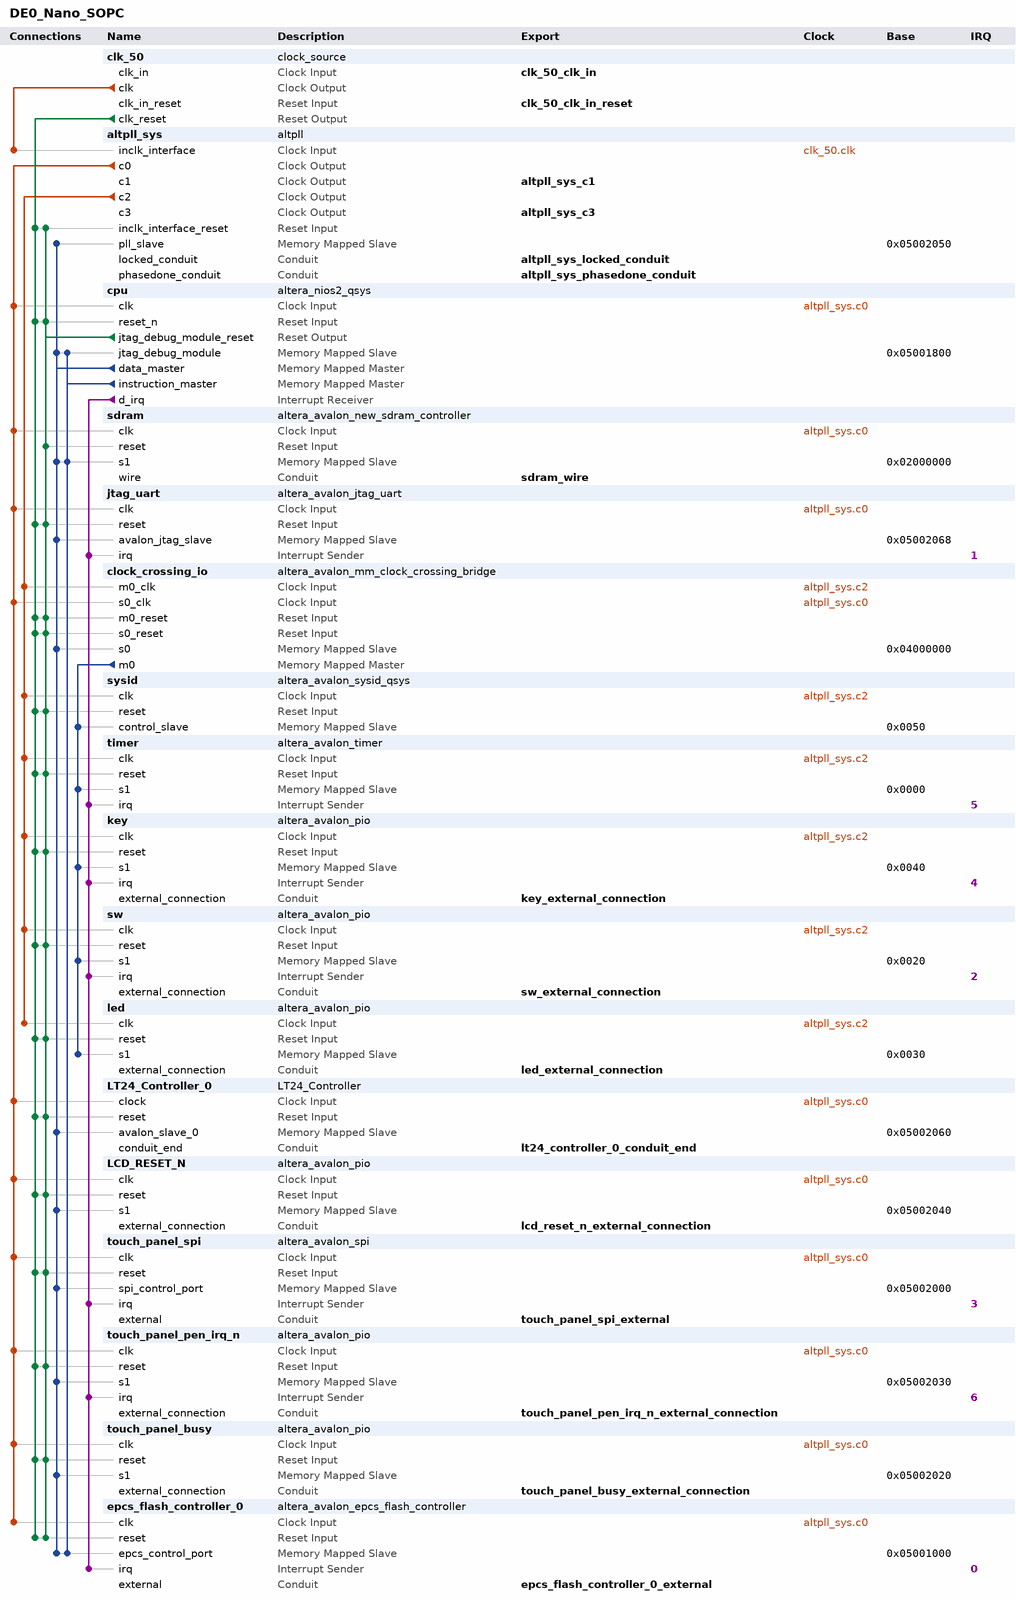
[diagram p0: system contents]
# Platform Designer (Qsys) system DE0_Nano_SOPC, Cyclone IV E EP4CE22F17C6
# Parameters at their usual value, and those the tool derives, are not listed.
package require -exact qsys 13.1
create_system DE0_Nano_SOPC
set_project_property DEVICE_FAMILY {Cyclone IV E}
set_project_property DEVICE EP4CE22F17C6

add_instance clk_50 clock_source 13.1
set_instance_parameter_value clk_50 clockFrequency 50000000

add_instance altpll_sys altpll 13.1
set_instance_parameter_value altpll_sys INCLK0_INPUT_FREQUENCY 20000
set_instance_parameter_value altpll_sys CLK0_MULTIPLY_BY 2
set_instance_parameter_value altpll_sys CLK1_MULTIPLY_BY 2
set_instance_parameter_value altpll_sys CLK2_MULTIPLY_BY 1
set_instance_parameter_value altpll_sys CLK3_MULTIPLY_BY 4
set_instance_parameter_value altpll_sys CLK4_MULTIPLY_BY 1
set_instance_parameter_value altpll_sys CLK0_DIVIDE_BY 1
set_instance_parameter_value altpll_sys CLK1_DIVIDE_BY 1
set_instance_parameter_value altpll_sys CLK2_DIVIDE_BY 5
set_instance_parameter_value altpll_sys CLK3_DIVIDE_BY 5
set_instance_parameter_value altpll_sys CLK4_DIVIDE_BY 25
set_instance_parameter_value altpll_sys CLK1_PHASE_SHIFT -2500
set_instance_parameter_value altpll_sys CLK2_PHASE_SHIFT 0
set_instance_parameter_value altpll_sys CLK3_PHASE_SHIFT 0
set_instance_parameter_value altpll_sys CLK4_PHASE_SHIFT 0
set_instance_parameter_value altpll_sys CLK1_DUTY_CYCLE 50
set_instance_parameter_value altpll_sys CLK2_DUTY_CYCLE 50
set_instance_parameter_value altpll_sys CLK3_DUTY_CYCLE 50
set_instance_parameter_value altpll_sys CLK4_DUTY_CYCLE 50
set_instance_parameter_value altpll_sys PORT_clk1 PORT_USED
set_instance_parameter_value altpll_sys PORT_clk2 PORT_USED
set_instance_parameter_value altpll_sys PORT_clk3 PORT_USED
set_instance_parameter_value altpll_sys PORT_clk4 PORT_USED
set_instance_parameter_value altpll_sys PORT_ARESET PORT_USED
set_instance_parameter_value altpll_sys PORT_LOCKED PORT_USED

add_instance cpu altera_nios2_qsys 13.1
set_instance_parameter_value cpu manuallyAssignCpuID false
set_instance_parameter_value cpu resetSlave epcs_flash_controller_0.epcs_control_port
set_instance_parameter_value cpu exceptionSlave sdram.s1
set_instance_parameter_value cpu breakSlave cpu.jtag_debug_module
set_instance_parameter_value cpu impl Fast
set_instance_parameter_value cpu icache_size 4096

add_instance sdram altera_avalon_new_sdram_controller 13.1
set_instance_parameter_value sdram TAC 5.5
set_instance_parameter_value sdram TRCD 20.0
set_instance_parameter_value sdram TRP 20.0
set_instance_parameter_value sdram casLatency 3
set_instance_parameter_value sdram columnWidth 9
set_instance_parameter_value sdram dataWidth 16
set_instance_parameter_value sdram generateSimulationModel true
set_instance_parameter_value sdram model custom
set_instance_parameter_value sdram numberOfBanks 4
set_instance_parameter_value sdram numberOfChipSelects 1
set_instance_parameter_value sdram powerUpDelay 100.0
set_instance_parameter_value sdram refreshPeriod 15.625
set_instance_parameter_value sdram rowWidth 13

add_instance jtag_uart altera_avalon_jtag_uart 13.1
set_instance_parameter_value jtag_uart simInteractiveOptions INTERACTIVE_ASCII_OUTPUT

add_instance clock_crossing_io altera_avalon_mm_clock_crossing_bridge 13.1
set_instance_parameter_value clock_crossing_io DATA_WIDTH 32
set_instance_parameter_value clock_crossing_io ADDRESS_WIDTH 7
set_instance_parameter_value clock_crossing_io MAX_BURST_SIZE 1
set_instance_parameter_value clock_crossing_io COMMAND_FIFO_DEPTH 16
set_instance_parameter_value clock_crossing_io RESPONSE_FIFO_DEPTH 32
set_instance_parameter_value clock_crossing_io MASTER_SYNC_DEPTH 3
set_instance_parameter_value clock_crossing_io SLAVE_SYNC_DEPTH 3

add_instance sysid altera_avalon_sysid_qsys 13.1
set_instance_parameter_value sysid id 0

add_instance timer altera_avalon_timer 13.1
set_instance_parameter_value timer period 1
set_instance_parameter_value timer periodUnits MSEC

add_instance key altera_avalon_pio 13.1
set_instance_parameter_value key captureEdge true
set_instance_parameter_value key direction Input
set_instance_parameter_value key edgeType FALLING
set_instance_parameter_value key generateIRQ true
set_instance_parameter_value key irqType EDGE
set_instance_parameter_value key width 2

add_instance sw altera_avalon_pio 13.1
set_instance_parameter_value sw captureEdge true
set_instance_parameter_value sw direction Input
set_instance_parameter_value sw edgeType ANY
set_instance_parameter_value sw generateIRQ true
set_instance_parameter_value sw irqType EDGE
set_instance_parameter_value sw width 4

add_instance led altera_avalon_pio 13.1
set_instance_parameter_value led direction Output
set_instance_parameter_value led width 8

add_instance LT24_Controller_0 LT24_Controller 1.0

add_instance LCD_RESET_N altera_avalon_pio 13.1
set_instance_parameter_value LCD_RESET_N direction Output
set_instance_parameter_value LCD_RESET_N width 1

add_instance touch_panel_spi altera_avalon_spi 13.1
set_instance_parameter_value touch_panel_spi clockPolarity 0
set_instance_parameter_value touch_panel_spi dataWidth 8
set_instance_parameter_value touch_panel_spi masterSPI true
set_instance_parameter_value touch_panel_spi numberOfSlaves 1
set_instance_parameter_value touch_panel_spi targetClockRate 32000

add_instance touch_panel_pen_irq_n altera_avalon_pio 13.1
set_instance_parameter_value touch_panel_pen_irq_n captureEdge true
set_instance_parameter_value touch_panel_pen_irq_n direction Input
set_instance_parameter_value touch_panel_pen_irq_n edgeType FALLING
set_instance_parameter_value touch_panel_pen_irq_n generateIRQ true
set_instance_parameter_value touch_panel_pen_irq_n irqType EDGE
set_instance_parameter_value touch_panel_pen_irq_n width 1

add_instance touch_panel_busy altera_avalon_pio 13.1
set_instance_parameter_value touch_panel_busy direction Input
set_instance_parameter_value touch_panel_busy width 1

add_instance epcs_flash_controller_0 altera_avalon_epcs_flash_controller 13.1

# connections
add_connection altpll_sys.c0 clock_crossing_io.s0_clk clock
add_connection altpll_sys.c0 cpu.clk clock
add_connection altpll_sys.c0 epcs_flash_controller_0.clk clock
add_connection altpll_sys.c0 jtag_uart.clk clock
add_connection altpll_sys.c0 LCD_RESET_N.clk clock
add_connection altpll_sys.c0 LT24_Controller_0.clock clock
add_connection altpll_sys.c0 sdram.clk clock
add_connection altpll_sys.c0 touch_panel_busy.clk clock
add_connection altpll_sys.c0 touch_panel_pen_irq_n.clk clock
add_connection altpll_sys.c0 touch_panel_spi.clk clock
add_connection altpll_sys.c2 clock_crossing_io.m0_clk clock
add_connection altpll_sys.c2 key.clk clock
add_connection altpll_sys.c2 led.clk clock
add_connection altpll_sys.c2 sw.clk clock
add_connection altpll_sys.c2 sysid.clk clock
add_connection altpll_sys.c2 timer.clk clock
add_connection clk_50.clk altpll_sys.inclk_interface clock
add_connection clk_50.clk_reset altpll_sys.inclk_interface_reset reset
add_connection clk_50.clk_reset clock_crossing_io.m0_reset reset
add_connection clk_50.clk_reset clock_crossing_io.s0_reset reset
add_connection clk_50.clk_reset cpu.reset_n reset
add_connection clk_50.clk_reset epcs_flash_controller_0.reset reset
add_connection clk_50.clk_reset jtag_uart.reset reset
add_connection clk_50.clk_reset key.reset reset
add_connection clk_50.clk_reset LCD_RESET_N.reset reset
add_connection clk_50.clk_reset led.reset reset
add_connection clk_50.clk_reset LT24_Controller_0.reset reset
add_connection clk_50.clk_reset sw.reset reset
add_connection clk_50.clk_reset sysid.reset reset
add_connection clk_50.clk_reset timer.reset reset
add_connection clk_50.clk_reset touch_panel_busy.reset reset
add_connection clk_50.clk_reset touch_panel_pen_irq_n.reset reset
add_connection clk_50.clk_reset touch_panel_spi.reset reset
add_connection cpu.jtag_debug_module_reset altpll_sys.inclk_interface_reset reset
add_connection cpu.jtag_debug_module_reset clock_crossing_io.m0_reset reset
add_connection cpu.jtag_debug_module_reset clock_crossing_io.s0_reset reset
add_connection cpu.jtag_debug_module_reset cpu.reset_n reset
add_connection cpu.jtag_debug_module_reset epcs_flash_controller_0.reset reset
add_connection cpu.jtag_debug_module_reset jtag_uart.reset reset
add_connection cpu.jtag_debug_module_reset key.reset reset
add_connection cpu.jtag_debug_module_reset LCD_RESET_N.reset reset
add_connection cpu.jtag_debug_module_reset led.reset reset
add_connection cpu.jtag_debug_module_reset LT24_Controller_0.reset reset
add_connection cpu.jtag_debug_module_reset sdram.reset reset
add_connection cpu.jtag_debug_module_reset sw.reset reset
add_connection cpu.jtag_debug_module_reset sysid.reset reset
add_connection cpu.jtag_debug_module_reset timer.reset reset
add_connection cpu.jtag_debug_module_reset touch_panel_busy.reset reset
add_connection cpu.jtag_debug_module_reset touch_panel_pen_irq_n.reset reset
add_connection cpu.jtag_debug_module_reset touch_panel_spi.reset reset
add_connection clock_crossing_io.m0 key.s1 avalon
set_connection_parameter_value clock_crossing_io.m0/key.s1 baseAddress 0x0040
add_connection clock_crossing_io.m0 led.s1 avalon
set_connection_parameter_value clock_crossing_io.m0/led.s1 baseAddress 0x0030
add_connection clock_crossing_io.m0 sw.s1 avalon
set_connection_parameter_value clock_crossing_io.m0/sw.s1 baseAddress 0x0020
add_connection clock_crossing_io.m0 sysid.control_slave avalon
set_connection_parameter_value clock_crossing_io.m0/sysid.control_slave baseAddress 0x0050
add_connection clock_crossing_io.m0 timer.s1 avalon
set_connection_parameter_value clock_crossing_io.m0/timer.s1 baseAddress 0x0000
add_connection cpu.data_master altpll_sys.pll_slave avalon
set_connection_parameter_value cpu.data_master/altpll_sys.pll_slave baseAddress 0x05002050
add_connection cpu.data_master clock_crossing_io.s0 avalon
set_connection_parameter_value cpu.data_master/clock_crossing_io.s0 baseAddress 0x04000000
add_connection cpu.data_master cpu.jtag_debug_module avalon
set_connection_parameter_value cpu.data_master/cpu.jtag_debug_module baseAddress 0x05001800
add_connection cpu.data_master epcs_flash_controller_0.epcs_control_port avalon
set_connection_parameter_value cpu.data_master/epcs_flash_controller_0.epcs_control_port baseAddress 0x05001000
add_connection cpu.data_master jtag_uart.avalon_jtag_slave avalon
set_connection_parameter_value cpu.data_master/jtag_uart.avalon_jtag_slave baseAddress 0x05002068
add_connection cpu.data_master LCD_RESET_N.s1 avalon
set_connection_parameter_value cpu.data_master/LCD_RESET_N.s1 baseAddress 0x05002040
add_connection cpu.data_master LT24_Controller_0.avalon_slave_0 avalon
set_connection_parameter_value cpu.data_master/LT24_Controller_0.avalon_slave_0 baseAddress 0x05002060
add_connection cpu.data_master sdram.s1 avalon
set_connection_parameter_value cpu.data_master/sdram.s1 baseAddress 0x02000000
add_connection cpu.data_master touch_panel_busy.s1 avalon
set_connection_parameter_value cpu.data_master/touch_panel_busy.s1 baseAddress 0x05002020
add_connection cpu.data_master touch_panel_pen_irq_n.s1 avalon
set_connection_parameter_value cpu.data_master/touch_panel_pen_irq_n.s1 baseAddress 0x05002030
add_connection cpu.data_master touch_panel_spi.spi_control_port avalon
set_connection_parameter_value cpu.data_master/touch_panel_spi.spi_control_port baseAddress 0x05002000
add_connection cpu.instruction_master cpu.jtag_debug_module avalon
set_connection_parameter_value cpu.instruction_master/cpu.jtag_debug_module baseAddress 0x05001800
add_connection cpu.instruction_master epcs_flash_controller_0.epcs_control_port avalon
set_connection_parameter_value cpu.instruction_master/epcs_flash_controller_0.epcs_control_port baseAddress 0x05001000
add_connection cpu.instruction_master sdram.s1 avalon
set_connection_parameter_value cpu.instruction_master/sdram.s1 baseAddress 0x02000000
add_connection cpu.d_irq epcs_flash_controller_0.irq interrupt
set_connection_parameter_value cpu.d_irq/epcs_flash_controller_0.irq irqNumber 0
add_connection cpu.d_irq jtag_uart.irq interrupt
set_connection_parameter_value cpu.d_irq/jtag_uart.irq irqNumber 1
add_connection cpu.d_irq key.irq interrupt
set_connection_parameter_value cpu.d_irq/key.irq irqNumber 4
add_connection cpu.d_irq sw.irq interrupt
set_connection_parameter_value cpu.d_irq/sw.irq irqNumber 2
add_connection cpu.d_irq timer.irq interrupt
set_connection_parameter_value cpu.d_irq/timer.irq irqNumber 5
add_connection cpu.d_irq touch_panel_pen_irq_n.irq interrupt
set_connection_parameter_value cpu.d_irq/touch_panel_pen_irq_n.irq irqNumber 6
add_connection cpu.d_irq touch_panel_spi.irq interrupt
set_connection_parameter_value cpu.d_irq/touch_panel_spi.irq irqNumber 3

# exported interfaces
add_interface key_external_connection conduit end
set_interface_property key_external_connection EXPORT_OF key.external_connection
add_interface clk_50_clk_in clock sink
set_interface_property clk_50_clk_in EXPORT_OF clk_50.clk_in
add_interface altpll_sys_locked_conduit conduit end
set_interface_property altpll_sys_locked_conduit EXPORT_OF altpll_sys.locked_conduit
add_interface clk_50_clk_in_reset reset sink
set_interface_property clk_50_clk_in_reset EXPORT_OF clk_50.clk_in_reset
add_interface led_external_connection conduit end
set_interface_property led_external_connection EXPORT_OF led.external_connection
add_interface altpll_sys_phasedone_conduit conduit end
set_interface_property altpll_sys_phasedone_conduit EXPORT_OF altpll_sys.phasedone_conduit
add_interface sdram_wire conduit end
set_interface_property sdram_wire EXPORT_OF sdram.wire
add_interface sw_external_connection conduit end
set_interface_property sw_external_connection EXPORT_OF sw.external_connection
add_interface altpll_sys_c3 clock source
set_interface_property altpll_sys_c3 EXPORT_OF altpll_sys.c3
add_interface altpll_sys_c1 clock source
set_interface_property altpll_sys_c1 EXPORT_OF altpll_sys.c1
add_interface lt24_controller_0_conduit_end conduit end
set_interface_property lt24_controller_0_conduit_end EXPORT_OF LT24_Controller_0.conduit_end
add_interface lcd_reset_n_external_connection conduit end
set_interface_property lcd_reset_n_external_connection EXPORT_OF LCD_RESET_N.external_connection
add_interface touch_panel_spi_external conduit end
set_interface_property touch_panel_spi_external EXPORT_OF touch_panel_spi.external
add_interface touch_panel_pen_irq_n_external_connection conduit end
set_interface_property touch_panel_pen_irq_n_external_connection EXPORT_OF touch_panel_pen_irq_n.external_connection
add_interface touch_panel_busy_external_connection conduit end
set_interface_property touch_panel_busy_external_connection EXPORT_OF touch_panel_busy.external_connection
add_interface epcs_flash_controller_0_external conduit end
set_interface_property epcs_flash_controller_0_external EXPORT_OF epcs_flash_controller_0.external

set_interconnect_requirement {$system} qsys_mm.clockCrossingAdapter HANDSHAKE
set_interconnect_requirement {$system} qsys_mm.maxAdditionalLatency 0

save_system DE0_Nano_SOPC.qsys
